# Altium schematic sheet 01_STM32F4最小系统.SchDoc
size A4
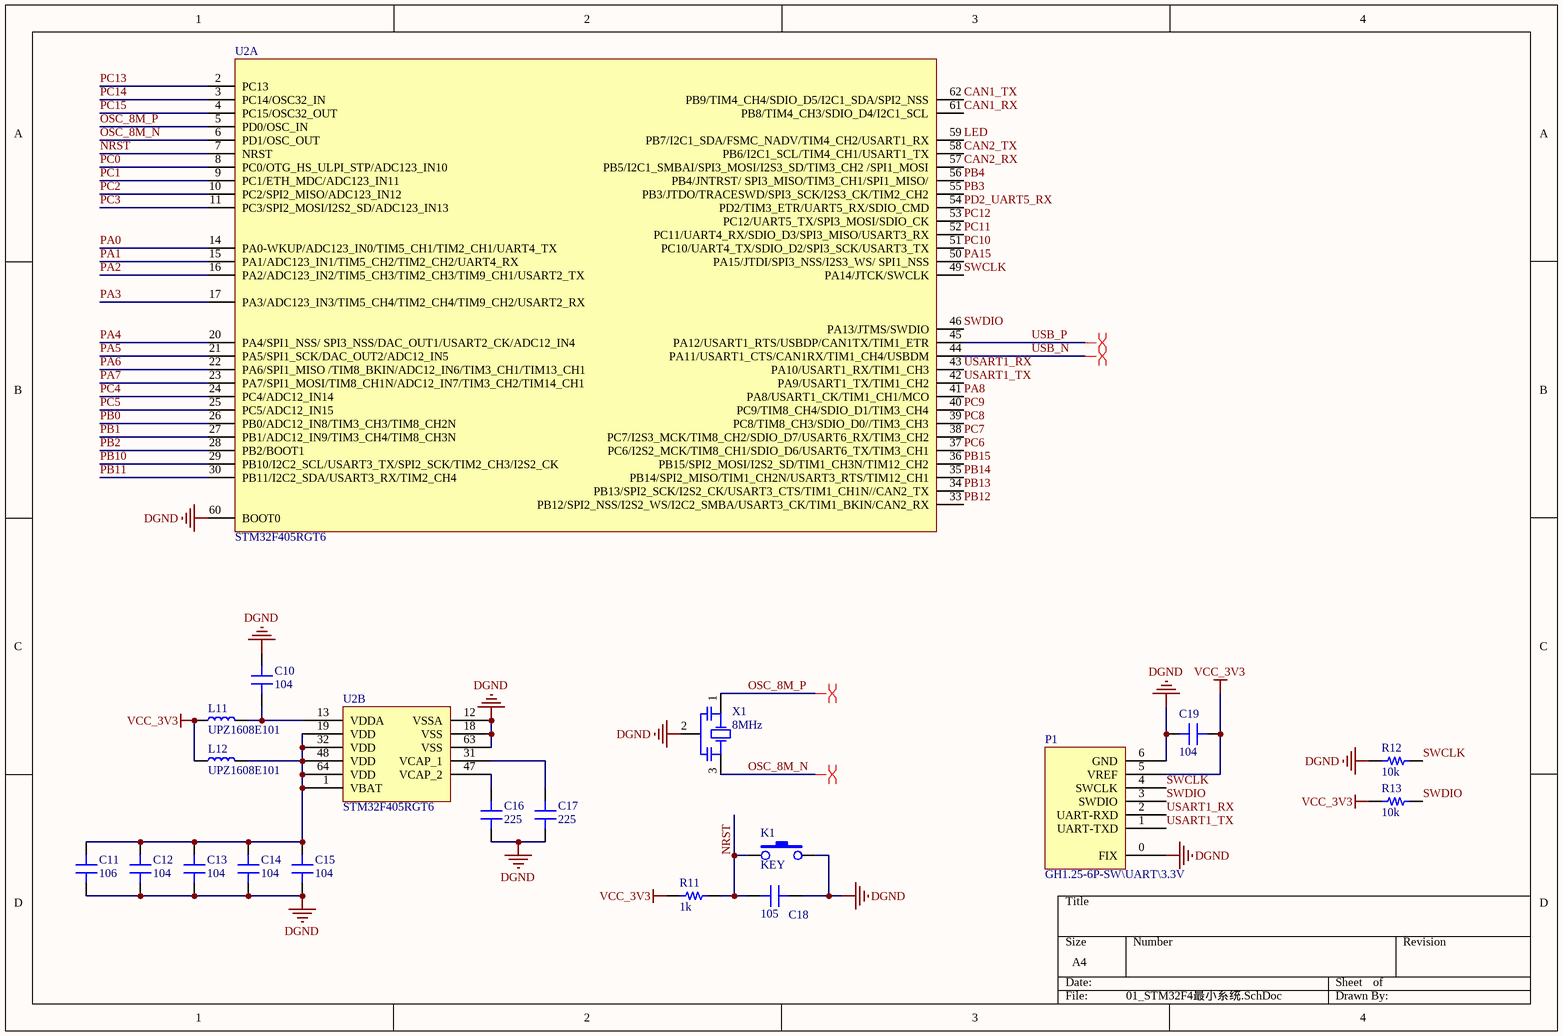
[diagram p0: 01_STM32F4最小系统.SchDoc]

## Parts
C10  104  [C0603/1608]
C11  106  [C0603/1608]
C12  104  [C0603/1608]
C13  104  [C0603/1608]
C14  104  [C0603/1608]
C15  104  [C0603/1608]
C16  225  [C0603/1608]
C17  225  [C0603/1608]
C18  105  [C0603/1608]
C19  104  [C0603/1608]
K1  KEY  [按键（2脚）]
L11  UPZ1608E101  [L0603/1608]
L12  UPZ1608E101  [L0603/1608]
P1  GH1.25-6P-SW\UART\3.3V  [GH1.25-6P（卧贴）]
R11  1k  [R0603/1608]
R12  10k  [R0603/1608]
R13  10k  [R0603/1608]
U2  STM32F405RGT6  [LQFP64]  (parts A,B of 2)
X1  8MHz  [XTAL-3213]

## Nets
DGND: C10.2 C11.1 C12.1 C13.1 C14.1 C15.1 C16.1 C17.1 C18.1 C19.2 K1.2 P1.0(FIX) P1.6(GND) R12.1 U2.12(VSSA) U2.18(VSS) U2.60(BOOT0) U2.63(VSS) X1.2(OSC2)
VCC_3V3: C19.1 L11.1 L12.1 P1.5(VREF) R11.1 R13.1
CAN1_RX: U2.61(PB8/TIM4_CH3/SDIO_D4/I2C1_SCL)
CAN1_TX: U2.62(PB9/TIM4_CH4/SDIO_D5/I2C1_SDA/SPI2_NSS)
CAN2_RX: U2.57(PB5/I2C1_SMBAI/SPI3_MOSI/I2S3_SD/TIM3_CH2_/SPI1_MOSI)
CAN2_TX: U2.58(PB6/I2C1_SCL/TIM4_CH1/USART1_TX)
LED: U2.59(PB7/I2C1_SDA/FSMC_NADV/TIM4_CH2/USART1_RX)
NRST: C18.2 K1.1 R11.2 U2.7(NRST)
OSC_8M_N: U2.6(PD1/OSC_OUT) X1.3(OSC3)
OSC_8M_P: U2.5(PD0/OSC_IN) X1.1(OSC1)
PA0: U2.14(PA0-WKUP/ADC123_IN0/TIM5_CH1/TIM2_CH1/UART4_TX)
PA1: U2.15(PA1/ADC123_IN1/TIM5_CH2/TIM2_CH2/UART4_RX)
PA2: U2.16(PA2/ADC123_IN2/TIM5_CH3/TIM2_CH3/TIM9_CH1/USART2_TX)
PA3: U2.17(PA3/ADC123_IN3/TIM5_CH4/TIM2_CH4/TIM9_CH2/USART2_RX)
PA4: U2.20(PA4/SPI1_NSS/_SPI3_NSS/DAC_OUT1/USART2_CK/ADC12_IN4)
PA5: U2.21(PA5/SPI1_SCK/DAC_OUT2/ADC12_IN5)
PA6: U2.22(PA6/SPI1_MISO_/TIM8_BKIN/ADC12_IN6/TIM3_CH1/TIM13_CH1)
PA7: U2.23(PA7/SPI1_MOSI/TIM8_CH1N/ADC12_IN7/TIM3_CH2/TIM14_CH1)
PA8: U2.41(PA8/USART1_CK/TIM1_CH1/MCO)
PA15: U2.50(PA15/JTDI/SPI3_NSS/I2S3_WS/_SPI1_NSS)
PB0: U2.26(PB0/ADC12_IN8/TIM3_CH3/TIM8_CH2N)
PB1: U2.27(PB1/ADC12_IN9/TIM3_CH4/TIM8_CH3N)
PB2: U2.28(PB2/BOOT1)
PB3: U2.55(PB3/JTDO/TRACESWD/SPI3_SCK/I2S3_CK/TIM2_CH2)
PB4: U2.56(PB4/JNTRST/_SPI3_MISO/TIM3_CH1/SPI1_MISO/)
PB10: U2.29(PB10/I2C2_SCL/USART3_TX/SPI2_SCK/TIM2_CH3/I2S2_CK)
PB11: U2.30(PB11/I2C2_SDA/USART3_RX/TIM2_CH4)
PB12: U2.33(PB12/SPI2_NSS/I2S2_WS/I2C2_SMBA/USART3_CK/TIM1_BKIN/CAN2_RX)
PB13: U2.34(PB13/SPI2_SCK/I2S2_CK/USART3_CTS/TIM1_CH1N//CAN2_TX)
PB14: U2.35(PB14/SPI2_MISO/TIM1_CH2N/USART3_RTS/TIM12_CH1)
PB15: U2.36(PB15/SPI2_MOSI/I2S2_SD/TIM1_CH3N/TIM12_CH2)
PC0: U2.8(PC0/OTG_HS_ULPI_STP/ADC123_IN10)
PC1: U2.9(PC1/ETH_MDC/ADC123_IN11)
PC2: U2.10(PC2/SPI2_MISO/ADC123_IN12)
PC3: U2.11(PC3/SPI2_MOSI/I2S2_SD/ADC123_IN13)
PC4: U2.24(PC4/ADC12_IN14)
PC5: U2.25(PC5/ADC12_IN15)
PC6: U2.37(PC6/I2S2_MCK/TIM8_CH1/SDIO_D6/USART6_TX/TIM3_CH1)
PC7: U2.38(PC7/I2S3_MCK/TIM8_CH2/SDIO_D7/USART6_RX/TIM3_CH2)
PC8: U2.39(PC8/TIM8_CH3/SDIO_D0//TIM3_CH3)
PC9: U2.40(PC9/TIM8_CH4/SDIO_D1/TIM3_CH4)
PC10: U2.51(PC10/UART4_TX/SDIO_D2/SPI3_SCK/USART3_TX)
PC11: U2.52(PC11/UART4_RX/SDIO_D3/SPI3_MISO/USART3_RX)
PC12: U2.53(PC12/UART5_TX/SPI3_MOSI/SDIO_CK)
PC13: U2.2(PC13)
PC14: U2.3(PC14/OSC32_IN)
PC15: U2.4(PC15/OSC32_OUT)
PD2_UART5_RX: U2.54(PD2/TIM3_ETR/UART5_RX/SDIO_CMD)
SWCLK: P1.4(SWCLK) R12.2 U2.49(PA14/JTCK/SWCLK)
SWDIO: P1.3(SWDIO) R13.2 U2.46(PA13/JTMS/SWDIO)
USART1_RX: P1.2(UART-RXD) U2.43(PA10/USART1_RX/TIM1_CH3)
USART1_TX: P1.1(UART-TXD) U2.42(PA9/USART1_TX/TIM1_CH2)
USB_N: U2.44(PA11/USART1_CTS/CAN1RX/TIM1_CH4/USBDM)
USB_P: U2.45(PA12/USART1_RTS/USBDP/CAN1TX/TIM1_ETR)
NetC10_1: C10.1 L11.2 U2.13(VDDA)
NetC11_2: C11.2 C12.2 C13.2 C14.2 C15.2 L12.2 U2.1(VBAT) U2.19(VDD) U2.32(VDD) U2.48(VDD) U2.64(VDD)
NetC16_2: C16.2 U2.47(VCAP_2)
NetC17_2: C17.2 U2.31(VCAP_1)

## Layout directives
differential pair: OSC_8M_N, OSC_8M_P, USB_N, USB_P

## Library data of the parts
C10-C19 = 陶瓷电容
K1 = 按键（2脚）: 按键-2脚贴片
L11 L12 = 磁珠: 贴片磁珠
R11-R13 = 电阻
U2 = STM32F405RGT6: 微控制器STM32F405RGT6
X1 = 晶振（带起振电容）: 晶振